# EasyEDA Pro project SSRC v1.eprj, schematic Schematic1
Board Name: Board1; Create Date: 2025-11-29; Page Name: P1; Project Name: SSRC v1; Schematic Name: Schematic1; Update Date: 2025-12-01; Company: EasyEDA.com; Page Size: A4; Version: V1.0
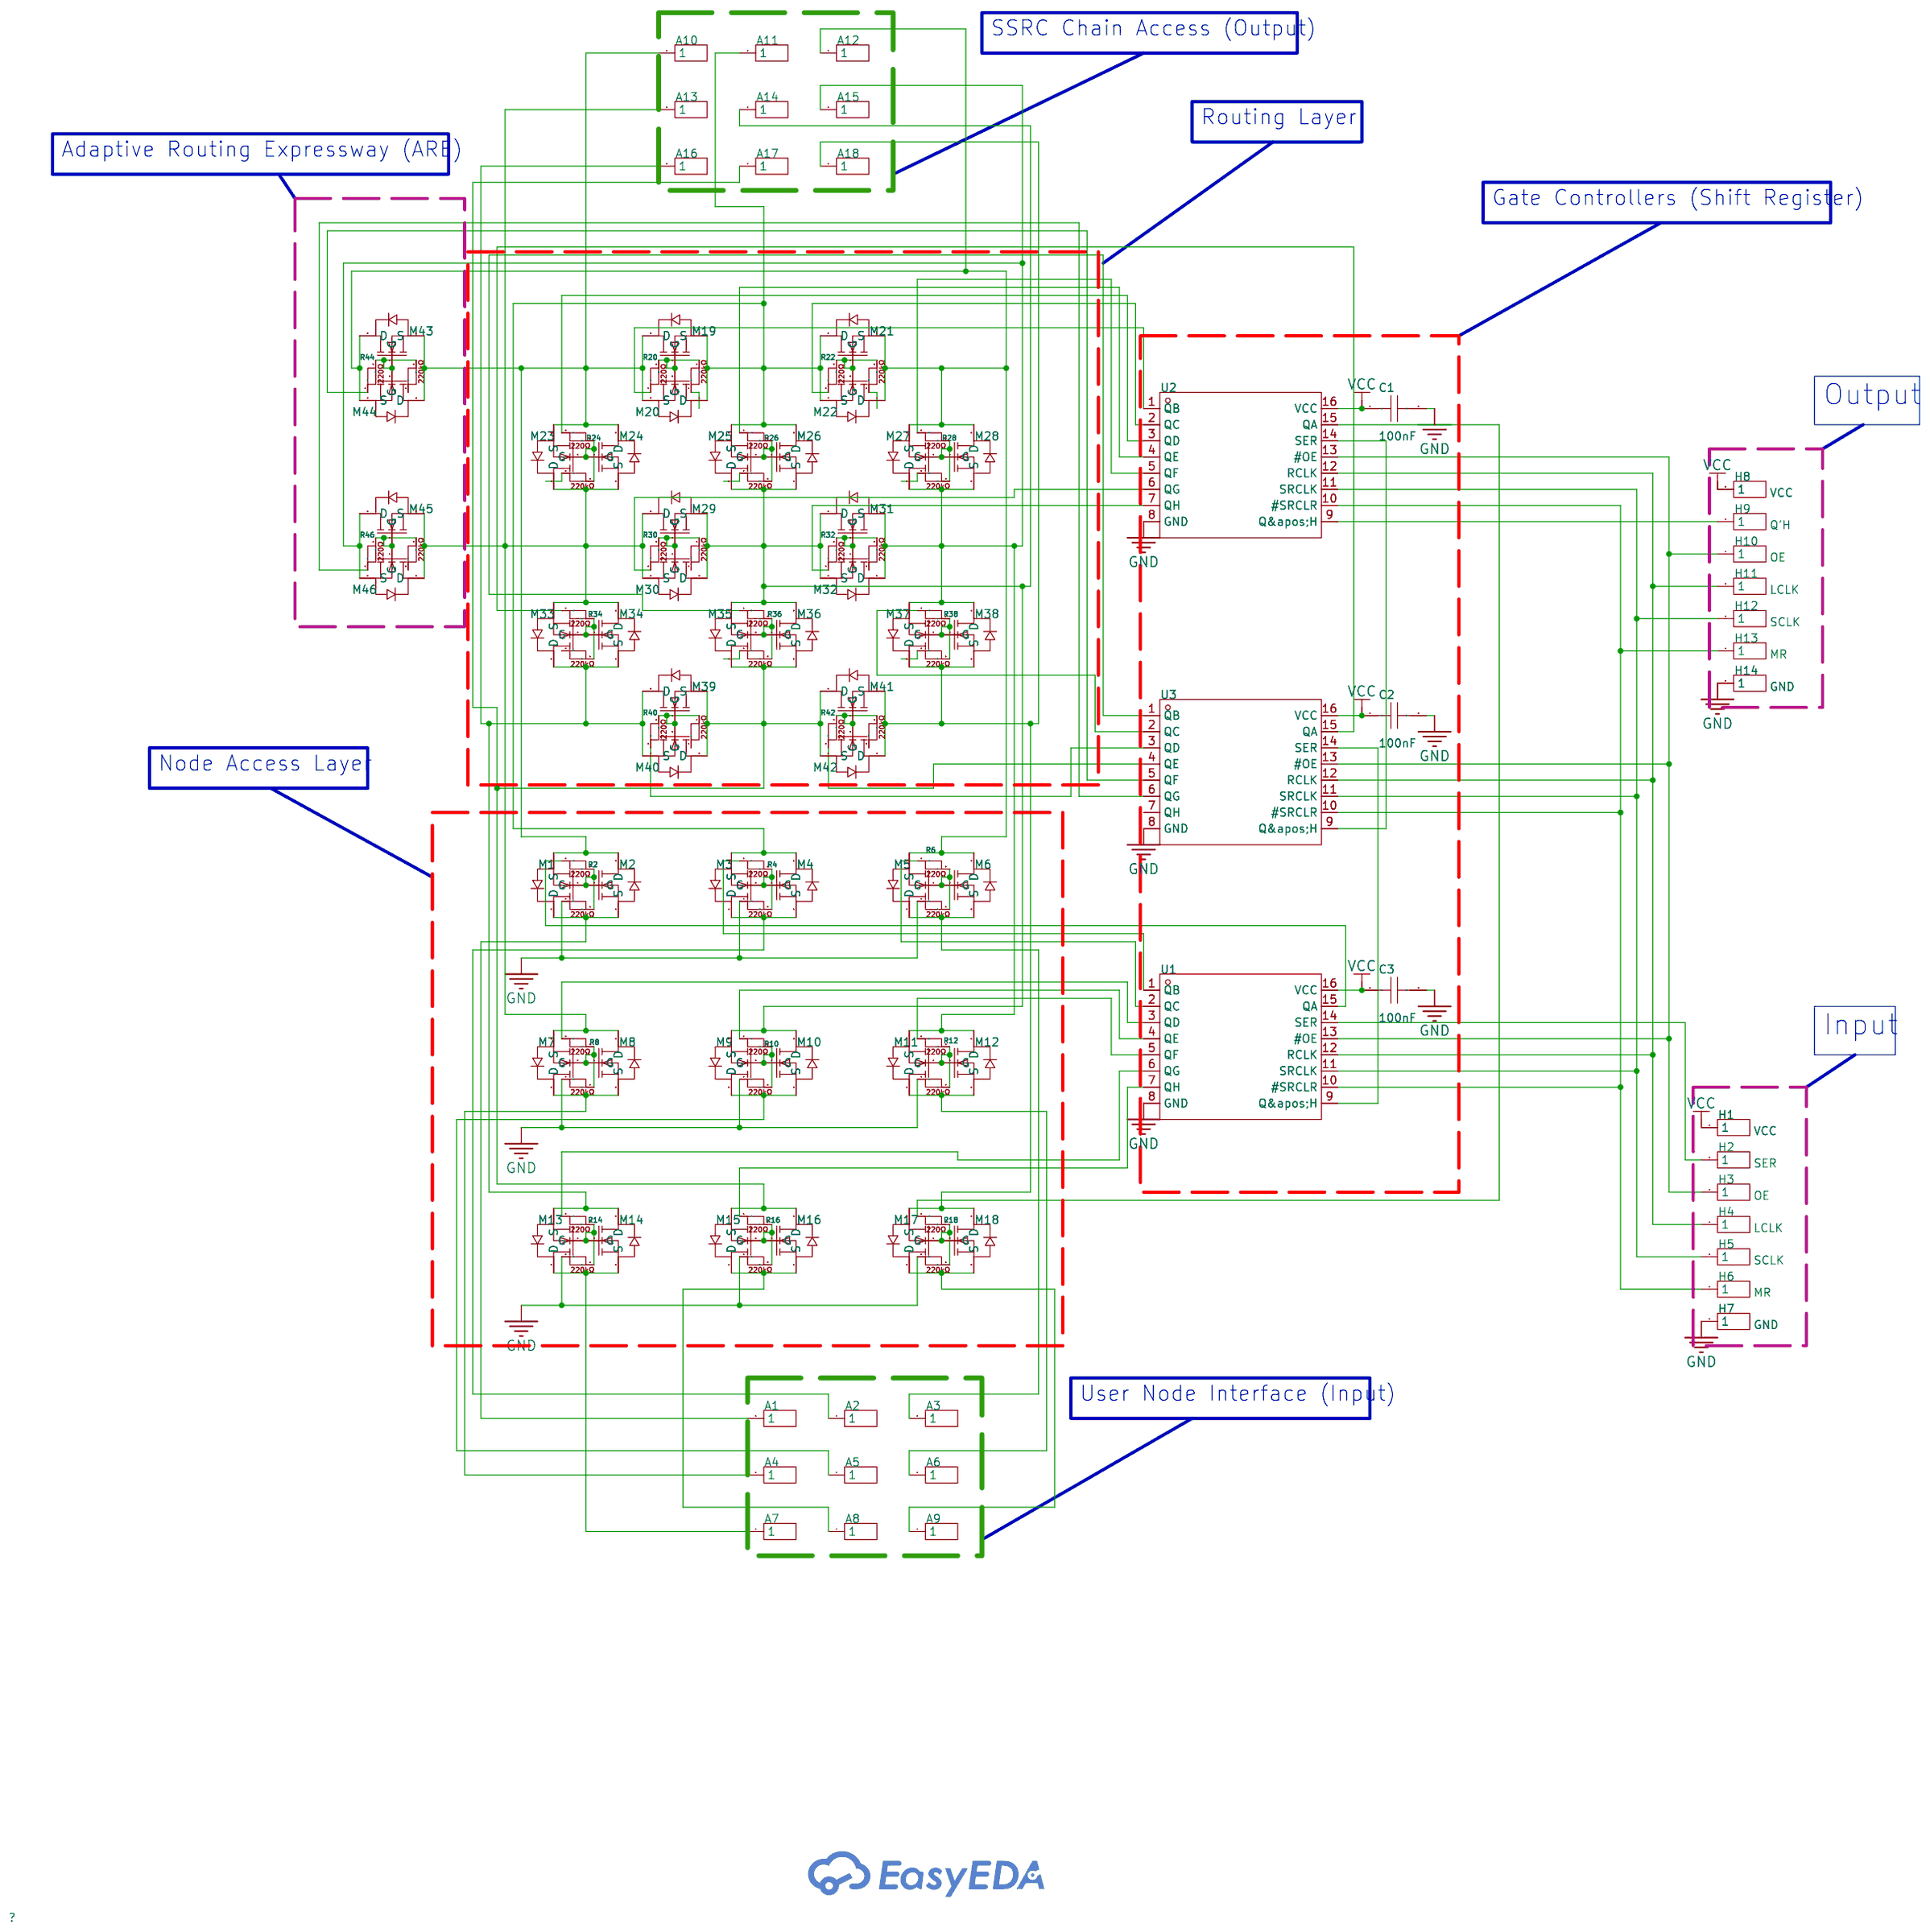
[diagram p0: schematic sheet]

## Parts
A1  VCC  [HDR-TH_1P-V-M_XKB_X4611WV-01I-C28D40]
A2  VCC  [HDR-TH_1P-V-M_XKB_X4611WV-01I-C28D40]
A3  VCC  [HDR-TH_1P-V-M_XKB_X4611WV-01I-C28D40]
A4  VCC  [HDR-TH_1P-V-M_XKB_X4611WV-01I-C28D40]
A5  VCC  [HDR-TH_1P-V-M_XKB_X4611WV-01I-C28D40]
A6  VCC  [HDR-TH_1P-V-M_XKB_X4611WV-01I-C28D40]
A7  VCC  [HDR-TH_1P-V-M_XKB_X4611WV-01I-C28D40]
A8  VCC  [HDR-TH_1P-V-M_XKB_X4611WV-01I-C28D40]
A9  VCC  [HDR-TH_1P-V-M_XKB_X4611WV-01I-C28D40]
A10  VCC  [HDR-TH_1P-V-M_XKB_X4611WV-01I-C28D40]
A11  VCC  [HDR-TH_1P-V-M_XKB_X4611WV-01I-C28D40]
A12  VCC  [HDR-TH_1P-V-M_XKB_X4611WV-01I-C28D40]
A13  VCC  [HDR-TH_1P-V-M_XKB_X4611WV-01I-C28D40]
A14  VCC  [HDR-TH_1P-V-M_XKB_X4611WV-01I-C28D40]
A15  VCC  [HDR-TH_1P-V-M_XKB_X4611WV-01I-C28D40]
A16  VCC  [HDR-TH_1P-V-M_XKB_X4611WV-01I-C28D40]
A17  VCC  [HDR-TH_1P-V-M_XKB_X4611WV-01I-C28D40]
A18  VCC  [HDR-TH_1P-V-M_XKB_X4611WV-01I-C28D40]
C1  100nF  [C0805]
C2  100nF  [C0805]
C3  100nF  [C0805]
H1  VCC  [HDR-TH_1P-V-M_XKB_X4611WV-01I-C28D40]
H2  SER  [HDR-TH_1P-V-M_XKB_X4611WV-01I-C28D40]
H3  OE  [HDR-TH_1P-V-M_XKB_X4611WV-01I-C28D40]
H4  LCLK  [HDR-TH_1P-V-M_XKB_X4611WV-01I-C28D40]
H5  SCLK  [HDR-TH_1P-V-M_XKB_X4611WV-01I-C28D40]
H6  MR  [HDR-TH_1P-V-M_XKB_X4611WV-01I-C28D40]
H7  GND  [HDR-TH_1P-V-M_XKB_X4611WV-01I-C28D40]
H8  VCC  [HDR-TH_1P-V-M_XKB_X4611WV-01I-C28D40]
H9  Q'H  [HDR-TH_1P-V-M_XKB_X4611WV-01I-C28D40]
H10  OE  [HDR-TH_1P-V-M_XKB_X4611WV-01I-C28D40]
H11  LCLK  [HDR-TH_1P-V-M_XKB_X4611WV-01I-C28D40]
H12  SCLK  [HDR-TH_1P-V-M_XKB_X4611WV-01I-C28D40]
H13  MR  [HDR-TH_1P-V-M_XKB_X4611WV-01I-C28D40]
H14  GND  [HDR-TH_1P-V-M_XKB_X4611WV-01I-C28D40]
M1  -  [SOT-23-3_L2.9-W1.3-P1.90-LS2.4-BR]
M2  -  [SOT-23-3_L2.9-W1.3-P1.90-LS2.4-BR]
M3  -  [SOT-23-3_L2.9-W1.3-P1.90-LS2.4-BR]
M4  -  [SOT-23-3_L2.9-W1.3-P1.90-LS2.4-BR]
M5  -  [SOT-23-3_L2.9-W1.3-P1.90-LS2.4-BR]
M6  -  [SOT-23-3_L2.9-W1.3-P1.90-LS2.4-BR]
M7  -  [SOT-23-3_L2.9-W1.3-P1.90-LS2.4-BR]
M8  -  [SOT-23-3_L2.9-W1.3-P1.90-LS2.4-BR]
M9  -  [SOT-23-3_L2.9-W1.3-P1.90-LS2.4-BR]
M10  -  [SOT-23-3_L2.9-W1.3-P1.90-LS2.4-BR]
M11  -  [SOT-23-3_L2.9-W1.3-P1.90-LS2.4-BR]
M12  -  [SOT-23-3_L2.9-W1.3-P1.90-LS2.4-BR]
M13  -  [SOT-23-3_L2.9-W1.3-P1.90-LS2.4-BR]
M14  -  [SOT-23-3_L2.9-W1.3-P1.90-LS2.4-BR]
M15  -  [SOT-23-3_L2.9-W1.3-P1.90-LS2.4-BR]
M16  -  [SOT-23-3_L2.9-W1.3-P1.90-LS2.4-BR]
M17  -  [SOT-23-3_L2.9-W1.3-P1.90-LS2.4-BR]
M18  -  [SOT-23-3_L2.9-W1.3-P1.90-LS2.4-BR]
M19  -  [SOT-23-3_L2.9-W1.3-P1.90-LS2.4-BR]
M20  -  [SOT-23-3_L2.9-W1.3-P1.90-LS2.4-BR]
M21  -  [SOT-23-3_L2.9-W1.3-P1.90-LS2.4-BR]
M22  -  [SOT-23-3_L2.9-W1.3-P1.90-LS2.4-BR]
M23  -  [SOT-23-3_L2.9-W1.3-P1.90-LS2.4-BR]
M24  -  [SOT-23-3_L2.9-W1.3-P1.90-LS2.4-BR]
M25  -  [SOT-23-3_L2.9-W1.3-P1.90-LS2.4-BR]
M26  -  [SOT-23-3_L2.9-W1.3-P1.90-LS2.4-BR]
M27  -  [SOT-23-3_L2.9-W1.3-P1.90-LS2.4-BR]
M28  -  [SOT-23-3_L2.9-W1.3-P1.90-LS2.4-BR]
M29  -  [SOT-23-3_L2.9-W1.3-P1.90-LS2.4-BR]
M30  -  [SOT-23-3_L2.9-W1.3-P1.90-LS2.4-BR]
M31  -  [SOT-23-3_L2.9-W1.3-P1.90-LS2.4-BR]
M32  -  [SOT-23-3_L2.9-W1.3-P1.90-LS2.4-BR]
M33  -  [SOT-23-3_L2.9-W1.3-P1.90-LS2.4-BR]
M34  -  [SOT-23-3_L2.9-W1.3-P1.90-LS2.4-BR]
M35  -  [SOT-23-3_L2.9-W1.3-P1.90-LS2.4-BR]
M36  -  [SOT-23-3_L2.9-W1.3-P1.90-LS2.4-BR]
M37  -  [SOT-23-3_L2.9-W1.3-P1.90-LS2.4-BR]
M38  -  [SOT-23-3_L2.9-W1.3-P1.90-LS2.4-BR]
M39  -  [SOT-23-3_L2.9-W1.3-P1.90-LS2.4-BR]
M40  -  [SOT-23-3_L2.9-W1.3-P1.90-LS2.4-BR]
M41  -  [SOT-23-3_L2.9-W1.3-P1.90-LS2.4-BR]
M42  -  [SOT-23-3_L2.9-W1.3-P1.90-LS2.4-BR]
M43  -  [SOT-23-3_L2.9-W1.3-P1.90-LS2.4-BR]
M44  -  [SOT-23-3_L2.9-W1.3-P1.90-LS2.4-BR]
M45  -  [SOT-23-3_L2.9-W1.3-P1.90-LS2.4-BR]
M46  -  [SOT-23-3_L2.9-W1.3-P1.90-LS2.4-BR]
R1  -  [RC1206FR-07220KL]
R2  -  [RC1206FR-1022RL]
R3  -  [RC1206FR-07220KL]
R4  -  [RC1206FR-1022RL]
R5  -  [RC1206FR-07220KL]
R6  -  [RC1206FR-1022RL]
R7  -  [RC1206FR-07220KL]
R8  -  [RC1206FR-1022RL]
R9  -  [RC1206FR-07220KL]
R10  -  [RC1206FR-1022RL]
R11  -  [RC1206FR-07220KL]
R12  -  [RC1206FR-1022RL]
R13  -  [RC1206FR-07220KL]
R14  -  [RC1206FR-1022RL]
R15  -  [RC1206FR-07220KL]
R16  -  [RC1206FR-1022RL]
R17  -  [RC1206FR-07220KL]
R18  -  [RC1206FR-1022RL]
R19  -  [RC1206FR-07220KL]
R20  -  [RC1206FR-1022RL]
R21  -  [RC1206FR-07220KL]
R22  -  [RC1206FR-1022RL]
R23  -  [RC1206FR-07220KL]
R24  -  [RC1206FR-1022RL]
R25  -  [RC1206FR-07220KL]
R26  -  [RC1206FR-1022RL]
R27  -  [RC1206FR-07220KL]
R28  -  [RC1206FR-1022RL]
R29  -  [RC1206FR-07220KL]
R30  -  [RC1206FR-1022RL]
R31  -  [RC1206FR-07220KL]
R32  -  [RC1206FR-1022RL]
R33  -  [RC1206FR-07220KL]
R34  -  [RC1206FR-1022RL]
R35  -  [RC1206FR-07220KL]
R36  -  [RC1206FR-1022RL]
R37  -  [RC1206FR-07220KL]
R38  -  [RC1206FR-1022RL]
R39  -  [RC1206FR-07220KL]
R40  -  [RC1206FR-1022RL]
R41  -  [RC1206FR-07220KL]
R42  -  [RC1206FR-1022RL]
R43  -  [RC1206FR-07220KL]
R44  -  [RC1206FR-1022RL]
R45  -  [RC1206FR-07220KL]
R46  -  [RC1206FR-1022RL]
U1  SN74HC595NSR  [SOP-16_L10.3-W5.4-P1.27-LS7.8-BL]
U2  SN74HC595NSR  [SOP-16_L10.3-W5.4-P1.27-LS7.8-BL]
U3  SN74HC595NSR  [SOP-16_L10.3-W5.4-P1.27-LS7.8-BL]

## Library data of the parts
A1-A18 H1-H14 = HDR-M_2.54_1x1P: Supplier Part: C81276; Supplier Footprint: 插件; JLCPCB Part Class: Extended Part; Mounting Type: Straight; Number of Rows: Plugin; Number of Pins: 1P; Color: Black
C1-C3 = CC0805KRX7R9BB104: LCSC Part Name: 100nF ±10% 50V; Supplier Part: C49678; Manufacturer: YAGEO(国巨); Supplier Footprint: 0805; JLCPCB Part Class: Basic Part; Datasheet: https://item.szlcsc.com/datasheet/CC0805KRX7R9BB104/50686.html; Supplier: LCSC; Tolerance: ±10%; Voltage Rating: 50V; Temperature Coefficient: X7R
M1-M46 = AO3400A_N: Supplier Footprint: SOT-23; Supplier Part: C700953; Type: 1个NChannel; Drain Source On Resistance (RDS(on)@Vgs,Id): 35mΩ@10V,5A; Gate Threshold Voltage (Vgs(th)@Id): 1.5V@250uA
R1 R3 R5 R7 R9 R11 R13 R15 R17 R19 R21 R23 R25 R27 R29 R31 R33 R35 R37 R39 R41 R43 R45 = RC1206FR-07220KL
R2 R4 R6 R8 R10 R12 R14 R16 R18 R20 R22 R24 R26 R28 R30 R32 R34 R36 R38 R40 R42 R44 R46 = RC1206FR-10220RL (mini schem)
U1-U3 = SN74HC595NSR: LCSC Part Name: 三态输出 8位串行至串行或并行移位寄存器; Supplier Part: C191873; Manufacturer: TI(德州仪器); Supplier Footprint: SOP-16-208mil; JLCPCB Part Class: Extended Part; Datasheet: https://www.ti.com/cn/lit/gpn/sn74hc595; Supplier: LCSC; Function: Serial-to-Serial or Parallel; Voltage - Supply: 2V~6V; Clock Frequency: 29MHz; Number of Bits per Element: 8; Output Type: Tri-State; Series: 74HC; Operating Temperature: -40℃~+85℃; Propagation Delay: 27ns@6V,50pF; Output Current: 6mA

## Nets
GND: C1.2 C2.2 C3.2 H7.1 H14.1 R1.1 R3.1 R5.1 R7.1 R9.1 R11.1 R13.1 R15.1 R17.1 U1.8(GND) U2.8(GND) U3.8(GND)
VCC: C1.1 C2.1 C3.1 H1.1 H8.1 U1.16(VCC) U2.16(VCC) U3.16(VCC)
Net-(A1-1): A1.1 M1.3(D) M2.2(S)
Net-(A2-1): A2.1 M3.3(D) M4.2(S)
Net-(A3-1): A3.1 M5.3(D) M6.2(S)
Net-(A4-1): A4.1 M7.3(D) M8.2(S)
Net-(A5-1): A5.1 M9.3(D) M10.2(S)
Net-(A6-1): A6.1 M11.3(D) M12.2(S)
Net-(A7-1): A7.1 M13.3(D) M14.2(S)
Net-(A8-1): A8.1 M15.3(D) M16.2(S)
Net-(A9-1): A9.1 M17.3(D) M18.2(S)
Net-(A10-1): A10.1 M1.2(S) M2.3(D) M19.3(D) M20.2(S) M23.2(S) M24.3(D) M43.2(S) M44.3(D)
Net-(A11-1): A11.1 M3.2(S) M4.3(D) M19.2(S) M20.3(D) M21.3(D) M22.2(S) M25.2(S) M26.3(D)
Net-(A12-1): A12.1 M5.2(S) M6.3(D) M21.2(S) M22.3(D) M27.2(S) M28.3(D) M43.3(D) M44.2(S)
Net-(A13-1): A13.1 M7.2(S) M8.3(D) M23.3(D) M24.2(S) M29.3(D) M30.2(S) M33.2(S) M34.3(D) M45.2(S) M46.3(D)
Net-(A14-1): A14.1 M9.2(S) M10.3(D) M25.3(D) M26.2(S) M29.2(S) M30.3(D) M31.3(D) M32.2(S) M35.2(S) M36.3(D)
Net-(A15-1): A15.1 M11.2(S) M12.3(D) M27.3(D) M28.2(S) M31.2(S) M32.3(D) M37.2(S) M38.3(D) M45.3(D) M46.2(S)
Net-(A16-1): A16.1 M13.2(S) M14.3(D) M33.3(D) M34.2(S) M39.3(D) M40.2(S)
Net-(A17-1): A17.1 M15.2(S) M16.3(D) M35.3(D) M36.2(S) M39.2(S) M40.3(D) M41.3(D) M42.2(S)
Net-(A18-1): A18.1 M17.2(S) M18.3(D) M37.3(D) M38.2(S) M41.2(S) M42.3(D)
Net-(H2-1): H2.1 U1.14(SER)
Net-(H3-1): H3.1 H10.1 U1.13(#OE) U2.13(#OE) U3.13(#OE)
Net-(H4-1): H4.1 H11.1 U1.12(RCLK) U2.12(RCLK) U3.12(RCLK)
Net-(H5-1): H5.1 H12.1 U1.11(SRCLK) U2.11(SRCLK) U3.11(SRCLK)
Net-(H6-1): H6.1 H13.1 U1.10(#SRCLR) U2.10(#SRCLR) U3.10(#SRCLR)
Net-(H9-1): H9.1 U2.9(Q&apos;H)
Net-(M1-1): M1.1(G) M2.1(G) R1.2(1) R2.2(1)
Net-(M3-1): M3.1(G) M4.1(G) R3.2(1) R4.2(1)
Net-(M5-1): M5.1(G) M6.1(G) R5.2(1) R6.2(1)
Net-(M7-1): M7.1(G) M8.1(G) R7.2(1) R8.2(1)
Net-(M9-1): M9.1(G) M10.1(G) R9.2(1) R10.2(1)
Net-(M11-1): M11.1(G) M12.1(G) R11.2(1) R12.2(1)
Net-(M13-1): M13.1(G) M14.1(G) R13.2(1) R14.2(1)
Net-(M15-1): M15.1(G) M16.1(G) R15.2(1) R16.2(1)
Net-(M17-1): M17.1(G) M18.1(G) R17.2(1) R18.2(1)
Net-(M19-1): M19.1(G) M20.1(G) R19.2(1) R20.2(1)
Net-(M21-1): M21.1(G) M22.1(G) R21.2(1) R22.2(1)
Net-(M23-1): M23.1(G) M24.1(G) R23.2(1) R24.2(1)
Net-(M25-1): M25.1(G) M26.1(G) R25.2(1) R26.2(1)
Net-(M27-1): M27.1(G) M28.1(G) R27.2(1) R28.2(1)
Net-(M29-1): M29.1(G) M30.1(G) R29.2(1) R30.2(1)
Net-(M31-1): M31.1(G) M32.1(G) R31.2(1) R32.2(1)
Net-(M33-1): M33.1(G) M34.1(G) R33.2(1) R34.2(1)
Net-(M35-1): M35.1(G) M36.1(G) R35.2(1) R36.2(1)
Net-(M37-1): M37.1(G) M38.1(G) R37.2(1) R38.2(1)
Net-(M39-1): M39.1(G) M40.1(G) R39.2(1) R40.2(1)
Net-(M41-1): M41.1(G) M42.1(G) R41.2(1) R42.2(1)
Net-(M43-1): M43.1(G) M44.1(G) R43.2(1) R44.2(1)
Net-(M45-1): M45.1(G) M46.1(G) R45.2(1) R46.2(1)
Net-(R2-1): R2.1 U1.15(QA)
Net-(R4-1): R4.1 U1.1(QB)
Net-(R6-1): R6.1 U1.2(QC)
Net-(R8-1): R8.1 U1.3(QD)
Net-(R10-1): R10.1 U1.4(QE)
Net-(R12-1): R12.1 U1.5(QF)
Net-(R14-1): R14.1 U1.6(QG)
Net-(R16-1): R16.1 U1.7(QH)
Net-(R18-1): R18.1 U2.15(QA)
Net-(R20-1): R20.1 U2.1(QB)
Net-(R22-1): R22.1 U2.2(QC)
Net-(R24-1): R24.1 U2.3(QD)
Net-(R26-1): R26.1 U2.4(QE)
Net-(R28-1): R28.1 U2.5(QF)
Net-(R30-1): R30.1 U2.6(QG)
Net-(R32-1): R32.1 U2.7(QH)
Net-(R34-1): R34.1 U3.15(QA)
Net-(R36-1): R36.1 U3.1(QB)
Net-(R38-1): R38.1 U3.2(QC)
Net-(R40-1): R40.1 U3.3(QD)
Net-(R42-1): R42.1 U3.4(QE)
Net-(R44-1): R44.1 U3.5(QF)
Net-(R46-1): R46.1 U3.6(QG)
Net-(U1-9): U1.9(Q&apos;H) U3.14(SER)
Net-(U2-14): U2.14(SER) U3.9(Q&apos;H)

Not connected (* = marked no-connect by the designer): R19 1; R21 1; R23 1; R25 1; R27 1; R29 1; R31 1; R33 1; R35 1; R37 1; R39 1; R41 1; R43 1; R45 1; U3 7(QH)

## Notes on the sheet
- SSRC Chain Access (Output)
- Routing Layer
- Adaptive Routing Expressway (ARE)
- Gate Controllers (Shift Register)
- Output
- Node Access Layer
- Input
- User Node Interface (Input)
